# Altium schematic sheet USB JTAG.SchDoc
size A3; SheetNumber: 9; SheetTotal: 16
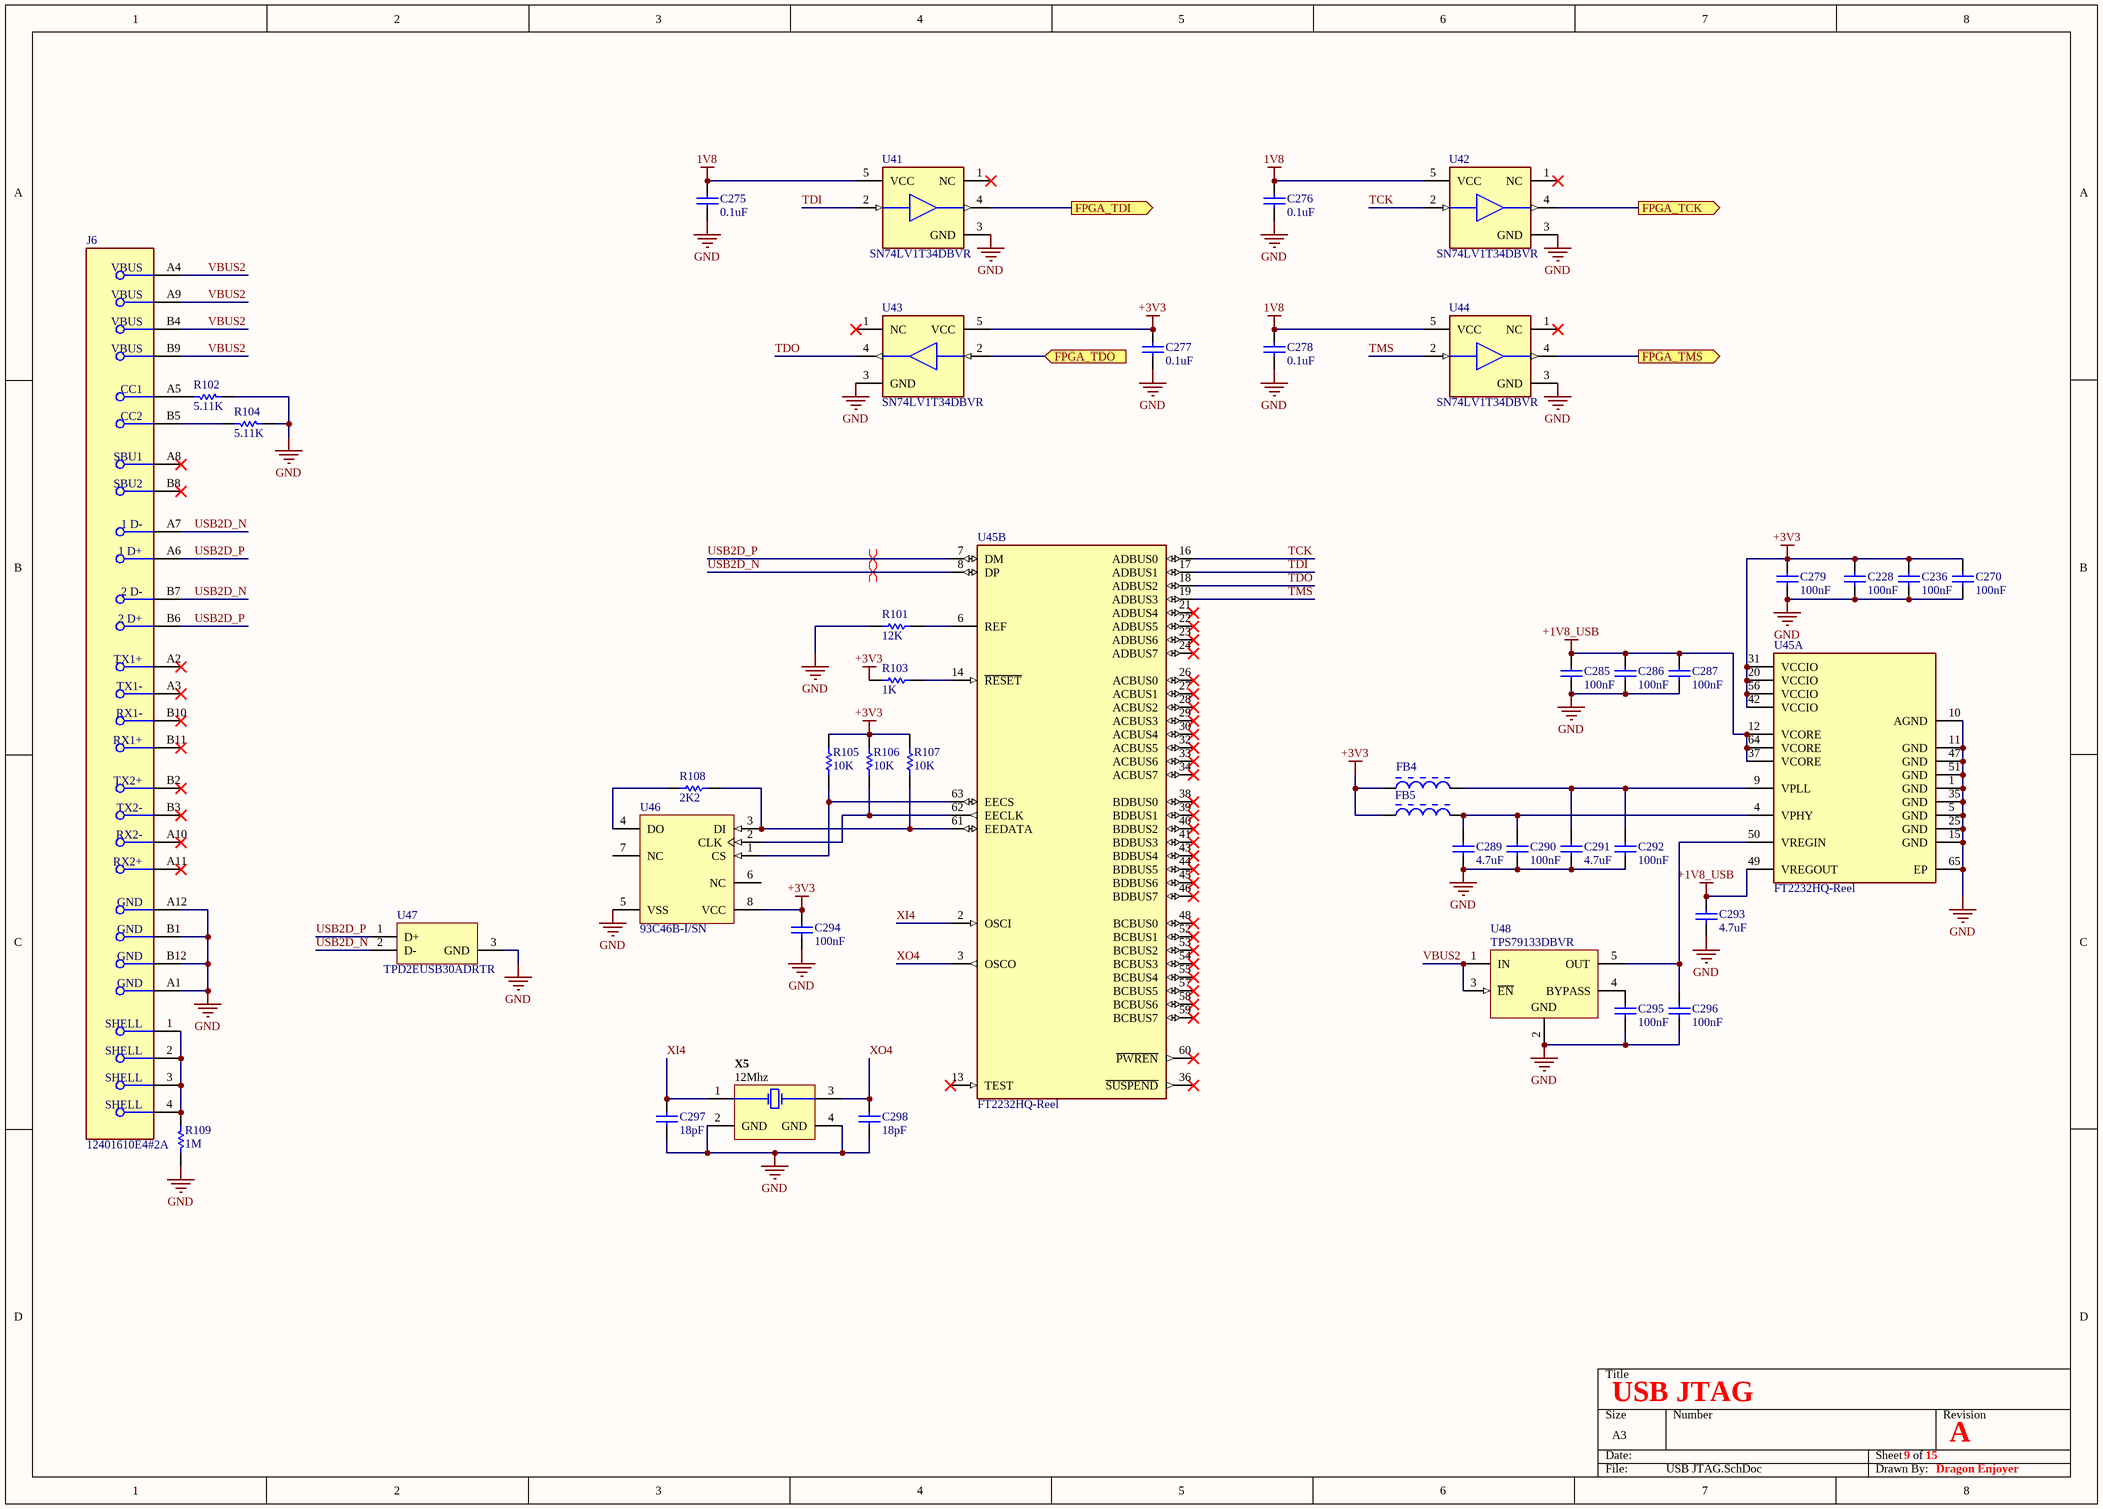
[diagram p0: USB JTAG.SchDoc]

## Parts
C228  100nF  [CAPC0603X33X15LL03T05]
C236  100nF  [CAPC0603X33X15LL03T05]
C270  100nF  [CAPC0603X33X15LL03T05]
C275  value 0.1uF  [CAPC1005X56X25LL10T15]  (hidden comment: 04026D104KAT2A)
C276  value 0.1uF  [CAPC1005X56X25LL10T15]  (hidden comment: 04026D104KAT2A)
C277  value 0.1uF  [CAPC1005X56X25LL10T15]  (hidden comment: 04026D104KAT2A)
C278  value 0.1uF  [CAPC1005X56X25LL10T15]  (hidden comment: 04026D104KAT2A)
C279  100nF  [CAPC0603X33X15LL03T05]
C285  100nF  [CAPC0603X33X15LL03T05]
C286  100nF  [CAPC0603X33X15LL03T05]
C287  100nF  [CAPC0603X33X15LL03T05]
C289  4.7uF  [CAPC1005X55X25LL05T10]
C290  100nF  [CAPC0603X33X15LL03T05]
C291  4.7uF  [CAPC1005X55X25LL05T10]
C292  100nF  [CAPC0603X33X15LL03T05]
C293  4.7uF  [CAPC1005X55X25LL05T10]
C294  100nF  [CAPC0603X33X15ML03T05]
C295  100nF  [CAPC0603X33X15LL03T05]
C296  100nF  [CAPC0603X33X15LL03T05]
C297  18pF  [CAPC1005X56X25ML10T15]
C298  18pF  [CAPC1005X56X25ML10T15]
FB4  BLM18PG121SN1D  [MURA-BLM18PG_KG-B25-CHIP-2_V1]  (value not drawn)
FB5  BLM18PG121SN1D  [MURA-BLM18PG_KG-B25-CHIP-2_V1]  (value not drawn)
J6  12401610E4#2A  [FP-12401610E4#2A-MFG]
R101  12K  [RESC1005X40X25NL05T05]
R102  value 5.11K  [RESC0603X28X15ML05T05]  (hidden comment: CRCW02015K11FNED)
R103  1K  [RESC1005X40X25NL05T05]
R104  value 5.11K  [RESC0603X28X15ML05T05]  (hidden comment: CRCW02015K11FNED)
R105  10K  [RESC1005X40X25NL05T05]
R106  10K  [RESC1005X40X25NL05T05]
R107  10K  [RESC1005X40X25NL05T05]
R108  2K2  [RESC1005X40X25NL05T05]
R109  value 1M  [RESC1005X40X25ML05T05]  (hidden comment: ERJ-2GEJ105X)
U41  SN74LV1T34DBVR  [FP-DBV0005A-IPC_B]
U42  SN74LV1T34DBVR  [FP-DBV0005A-IPC_B]
U43  SN74LV1T34DBVR  [FP-DBV0005A-IPC_B]
U44  SN74LV1T34DBVR  [FP-DBV0005A-IPC_B]
U45  FT2232HQ-Reel  [FP-FT2232HQ-Reel-MFG]  (parts A,B of 2)
U46  93C46B-I/SN  [SOIC-SN8_M]
U47  TPD2EUSB30ADRTR  [DRT0003A]
U48  TPS79133DBVR  [DBV0005A_N]
X5  12Mhz  [ABRACON_ABM8G_V]

## Ports
FPGA_TCK (out), FPGA_TDI (out), FPGA_TDO (in), FPGA_TMS (out)

## Nets
1V8: C275.2 C276.2 C278.2 U41.5(VCC) U42.5(VCC) U44.5(VCC)
+1V8_USB: C285.2 C286.2 C287.2 C293.2 U45.12(VCORE) U45.37(VCORE) U45.49(VREGOUT) U45.64(VCORE)
+3V3: C228.2 C236.2 C270.2 C277.2 C279.2 C294.2 FB4.1 FB5.1 R103.1 R105.2 R106.2 R107.2 U43.5(VCC) U45.20(VCCIO) U45.31(VCCIO) U45.42(VCCIO) U45.56(VCCIO) U46.8(VCC)
GND: C228.1 C236.1 C270.1 C275.1 C276.1 C277.1 C278.1 C279.1 C285.1 C286.1 C287.1 C289.1 C290.1 C291.1 C292.1 C293.1 C294.1 C295.1 C296.1 C297.1 C298.1 J6.A1(GND) J6.A12(GND) J6.B1(GND) J6.B12(GND) R101.1 R102.1 R104.1 R109.1 U41.3(GND) U42.3(GND) U43.3(GND) U44.3(GND) U45.1(GND) U45.5(GND) U45.10(AGND) U45.11(GND) U45.15(GND) U45.25(GND) U45.35(GND) U45.47(GND) U45.51(GND) U45.65(EP) U46.5(VSS) U47.3(GND) U48.2(GND) X5.2(GND) X5.4(GND)
FPGA_TCK: U42.4(Y) ; port FPGA_TCK
FPGA_TDI: U41.4(Y) ; port FPGA_TDI
FPGA_TDO: U43.2(A) ; port FPGA_TDO
FPGA_TMS: U44.4(Y) ; port FPGA_TMS
TCK: U42.2(A) U45.16(ADBUS0)
TDI: U41.2(A) U45.17(ADBUS1)
TDO: U43.4(Y) U45.18(ADBUS2)
TMS: U44.2(A) U45.19(ADBUS3)
USB2D_N: J6.A7(1_D-) J6.B7(2_D-) U45.8(DP) U47.2(D-)
USB2D_P: J6.A6(1_D+) J6.B6(2_D+) U45.7(DM) U47.1(D+)
VBUS2: J6.A4(VBUS) J6.A9(VBUS) J6.B4(VBUS) J6.B9(VBUS) U48.1(IN) U48.3(~{EN})
XI4: C297.2 U45.2(OSCI) X5.1(X1)
XO4: C298.2 U45.3(OSCO) X5.3(X2)
NetC289_2: C289.2 C290.2 FB5.2 U45.4(VPHY)
NetC291_2: C291.2 C292.2 FB4.2 U45.9(VPLL)
NetC295_2: C295.2 U48.4(BYPASS)
NetC296_2: C296.2 U45.50(VREGIN) U48.5(OUT)
NetJ6_1: J6.1(SHELL) J6.2(SHELL) J6.3(SHELL) J6.4(SHELL) R109.2
NetJ6_A5: J6.A5(CC1) R102.2
NetJ6_B5: J6.B5(CC2) R104.2
NetR101_2: R101.2 U45.6(REF)
NetR103_2: R103.2 U45.14(~{RESET})
NetR105_1: R105.1 U45.63(EECS) U46.1(CS)
NetR106_1: R106.1 U45.62(EECLK) U46.2(CLK)
NetR107_1: R107.1 R108.2 U45.61(EEDATA) U46.3(DI)
NetR108_1: R108.1 U46.4(DO)

Not connected (* = marked no-connect by the designer): J6 A2(TX1+)* A3(TX1-)* A8(SBU1)* A10(RX2-)* A11(RX2+)* B2(TX2+)* B3(TX2-)* B8(SBU2)* B10(RX1-)* B11(RX1+)*; U41 1(NC)*; U42 1(NC)*; U43 1(NC)*; U44 1(NC)*; U45 13(TEST)* 21(ADBUS4)* 22(ADBUS5)* 23(ADBUS6)* 24(ADBUS7)* 26(ACBUS0)* 27(ACBUS1)* 28(ACBUS2)* 29(ACBUS3)* 30(ACBUS4)* 32(ACBUS5)* 33(ACBUS6)* 34(ACBUS7)* 36(~{SUSPEND})* 38(BDBUS0)* 39(BDBUS1)* 40(BDBUS2)* 41(BDBUS3)* 43(BDBUS4)* 44(BDBUS5)* 45(BDBUS6)* 46(BDBUS7)* 48(BCBUS0)* 52(BCBUS1)* 53(BCBUS2)* 54(BCBUS3)* 55(BCBUS4)* 57(BCBUS5)* 58(BCBUS6)* 59(BCBUS7)* 60(~{PWREN})*; U46 6(NC) 7(NC)

## Layout directives
differential pair: USB2D_N, USB2D_P

## Notes on the sheet
- USB JTAG
- 9
- 15
- A
- Dragon Enjoyer

## Library data of the parts
C228 C236 C270 C279 C285-C287 C290 C292 C294-C296 = CMP-2010-00159-1: Part Number: 02016D104KAT2A; Manufacturer: AVX Interconnect / Elco
C275-C278 = CMP-2008-02743-1: Manufacturer: AVX Interconnect / Elco; Part Number: 04026D104KAT2A
C289 C291 C293 = CMP-2008-04549-1: Part Number: GRM155R60J475ME47D; Manufacturer: Murata
C297 C298 = CMP-2008-02592-1: Part Number: 04025A180JAT2A; Manufacturer: AVX Interconnect / Elco
FB4 FB5 = CMP-0686-00557-6: Chip Ferrite Bead for Power Lines, 120 Ohm, 2000 mA, -55 to 125 degC, 1.6 x 0.8 x 0.95 mm SMD, Tape and Reel; Manufacturer: Murata; Impedance (at 100 MHz): 120 Ohm +/- 25%; Rated Current: 2000 mA; DC Resistance: 0.05 Ohm Max.; DatasheetVersion: 08/2013; PackageDescription: 2-Pin Chip, Body 1.6 x 0.8 mm; ComponentLink3URL: http://www.murata.com/products/catalog/pdf/c31e.pdf; PartNumber: BLM18PG121SN1D; ComponentLink1URL: http://www.murata.com/; ComponentLink2Description: Datasheet; Mounting Technology: Surface Mount; ComponentLink1Description: Manufacturer URL; PackageReference: BLM18_H950-2; ComponentLink2URL: http://www.murata.com/products/catalog/pdf/c31e.pdf; ComponentLink3Description: Package Specification; Packing: Tape and Reel; Operating Temperature Range: -55 to 125 degC
J6 = CMP-02355-000003-1: CONN RCP USB3.1 TYPEC 24P SMD RA; Connector Type: USB; Number of Contacts: 24; Gender: Receptacle; Packaging: Cut Tape; Mount: Surface Mount; Number of Pins: 24
R101 = CMP-2002-08177-1: Part Number: CRCW040212K0FKED; Manufacturer: Vishay Dale
R102 R104 = CMP-2004-00740-1: Manufacturer: Vishay Dale; Part Number: CRCW02015K11FNED
R103 = CMP-2002-08276-1: Manufacturer: Vishay Dale; Part Number: CRCW04021K00FKED
R105-R107 = CMP-2002-08136-1: Manufacturer: Vishay Dale; Part Number: CRCW040210K0JNED
R108 = CMP-2002-01132-1: Part Number: ERJ2RKF2201X; Manufacturer: Panasonic
R109 = CMP-1011-00146-2: Manufacturer: Panasonic; Part Number: ERJ-2GEJ105X
U41-U44 = CMP-0859-00123-4: IC BUF NON-INVERT 5.5V SOT23-5; Low Level Output Current: 8mA; Polarity: Non-Inverting; Number of Channels: 1; Propagation Delay: 15.5ns; High Level Output Current: -8mA; Quiescent Current: 1uA; Logic Function: Buffer; Min Supply Voltage: 1.6V; Min Operating Temperature: -40°C; Package Quantity: 3000; Max Operating Temperature: 125°C; Operating Supply Current: 8mA; Radiation Hardening: No; REACH SVHC: No SVHC; Number of Bits per Element: 1; Mount: Surface Mount; Number of Outputs: 1; Lead Free: Lead Free; Number of Pins: 5; Weight: 0.000353oz; Number of Output Lines: 1; Number of Elements: 1; Number of Input Lines: 1; Number of Bits: 1; Case/Package: SOT-23-5; Packaging: Tape and Reel; Max Supply Voltage: 5.5V; Number of Inputs: 1
U45 = CMP-194822-000001-2: IC USB HS DUAL UART/FIFO 64-QFN; Manufacturer: FTDI; Min Supply Voltage: 1.62V; Ciiva Ids: 1315829; Nominal Supply Current: 5-70mA; Standoff Height: 0mm; Import Ts: 1521843541; Number Of Ports: 1; Max Supply Voltage: 3.63V; Data Rate: 480Mbits/s; Interface: I2C,SPI,UART,USB,RS-232,RS-485,RS-422,Other; Usb Standard: USB 2.0; Octopart: https://octopart.com/ft2232hq-reel-ftdi-19172126; Ipc Land Pattern Name: QFN50P900X900X85-64; Ambient Temperature Range High: +85°C; RoHS: TRUE; Manufacturer Part Number: FT2232HQ-Reel; Automotive: No; Footprint Url: https://www.ftdichip.com/Support/Documents/TechnicalNotes/TN_166%20FTDI%20Example%20IC%20PCB%20Footprints.pdf; Temperature Range High: +85°C; ComponentLink2Description: Datasheet; Ambient Temperature Range Low: -40°C; Mouser Description: USB Interface IC USB HS to Dual UART/ FIFO/SPI/JTAG/I2C; ComponentLink2URL: https://www.ftdichip.com/Support/Documents/DataSheets/ICs/DS_FT2232H.pdf; Digikey Description: IC USB HS DUAL UART/FIFO 64-QFN; Release Date: 1383921489; Height: 0.9mm; Lead Free: Yes; Package: QFN64; Device Class L1: Integrated Circuits (ICs); Temperature: -40°C to +85°C; Temperature Range Low: -40°C; Category: IC; Device Class L2: Interface ICs; Device Class L3: USB Interface ICs
U46 = CMP-0162-00274-1: 1K, 64x16-bit, 5.0V Microwire Serial EEPROM, 8-Pin SOIC 150mil, Industrial Temperature; Code_IPC: SOIC127P600-8; PackageDescription: 8-Lead Plastic Small Outline (SN) - Narrow, 3.90mm Body [SOIC]; PackageVersion: revBB, Aug-2009; DatasheetVersion: revG, May-2008; PackageReference: SOIC-SN8; Code_JEDEC: MS-012
U47 = CMP-0326-00047-3: ESD / Surge Solution for High Speed, Low Voltage Interface, 2 Channels, -40 to +85 degC, 3-pin SOT (DRT), Green (RoHS & no Sb/Br); Manufacturer: Texas Instruments; IEC 61000-4-2 Air-Gap(+/- kV): 8; SubFamily: ESD Solution; 1394 / Firewire: TRUE; IO Leakage Current(nA): 10; Differential Capacitance(pF): 0.05; Breakdown Voltage(Min)(V): 4.5; IO Capacitance(Typ)(pF): 0.7; Mounting Technology: Surface Mount; PartNumber: TPD2EUSB30ADRTR; ComponentLink2URL: SamplesURL:http://www.ti.com/product/tpd2eusb30a#samples; IEC 61000-4-2 Contact(+/- kV): 8; PackageReference: DRT0003A; Eco-Plan: Green (RoHS & no Sb/Br); ComponentLink2Description: URL Link1; USB Full Speed: TRUE; USB High Speed: TRUE; PackageDescription: 3-Flat Lead Plastic Small Outline, 1 x 1 mm (inc leads), 0.35 mm Pitch; Serial ATA / eSATA: TRUE; ComponentLink1URL: http://www.ti.com/general/docs/lit/getliterature.tsp?genericPartNumber=TPD2EUSB30A&fileType=pdf; DatasheetVersion: SLVSAC2C; PackageVersion: revD, Jun-2008; ComponentLink1Description: Datasheet; HDMI: TRUE; USB Super Speed: TRUE
U48 = CMP-0394-00266-2: Single Output High PSRR LDO, 100 mA, Fixed 3.3 V Output, 2.7 to 5.5 V Input, 5-pin SOT-23 (DBV), -40 to 125 degC, Green (RoHS & no Sb/Br); Manufacturer: Texas Instruments; Rating: Catalog; Vout Adj(Min)(V): 3.3; Vin(Max)(V): 5.5; SubFamily: Single Channel LDO; Accuracy(%): 2; Iout(Max)(A): 0.1; Vin(Min)(V): 2.7; Vdo(Typ)(mV): 50; Iq(Typ)(mA): 0.2; PackageReference: DBV0005A; DatasheetVersion: SLVS325C; PartNumber: TPS79133DBVR; ComponentLink3URL: http://www.ti.com/litv/pdf/mpds018i; Eco-Plan: Green (RoHS & no Sb/Br); ComponentLink3Description: Package Specification; ComponentLink2Description: Datasheet; Vout Adj(Max)(V): 3.3; ComponentLink1URL: http://www.ti.com/; Fixed Output Options(V): 3.3; ComponentLink4URL: Samples URL:http://www.ti.com/product/tps79133#samples; ComponentLink2URL: http://www.ti.com/general/docs/lit/getliterature.tsp?genericPartNumber=TPS79133&fileType=pdf; ComponentLink1Description: Manufacturer URL; Code_JEDEC: MO-178; PackageDescription: 5-Pin Plastic Small Outline, Body 1.60 Ãƒâ€” 2.90 mm, Pitch 0.95 mm; PackageVersion: 4073253-4/K; ComponentLink4Description: URL Link1; Mounting Technology: Surface Mount
X5 = CMP-2000-05039-1: Ultra Miniature Ceramic Glass Sealed SMD Cryastal, 12 MHz, 18 pF, +/- 20 ppm, -40 to 85 degC, 4-Pin SMD, RoHS, Tape and Reel; Brand: ABRACON; ESR: 120Ohms; Case Length: 3.2mm; Tolerance: 20PPM; Frequency Stability: 30PPM; Case Height: 1mm; Case Width: 2.5mm; Load Capacitance: 18pF; Termination Style: SMD/SMT; Mounting Style: SMD/SMT; Factory Pack Quantity: 1000; Series: ABM8G; Datasheet Version: Apr-17; Manufacturer: ABRACON; Packaging: Reel; Manufacturer URL: http://www.abracon.com/; RoHS: Details; Package / Case: 3.2mmx2.5mm; Type: UltraMiniatureGlassSealedCrystal; Datasheet URL: https://datasheet.ciiva.com/15116/getdatasheetpartid-719790-15116701.pdf; Operating Temperature Range: -40Cto+85C; Frequency: 12MHz; Product Category: Crystals; Dimensions: 2.5mmWx3.2mmLx1mmH